# Altium project MCH_MAIN.PrjPcb (part 6 of 7)

## Sheet MB_clocking.SchDoc
size A
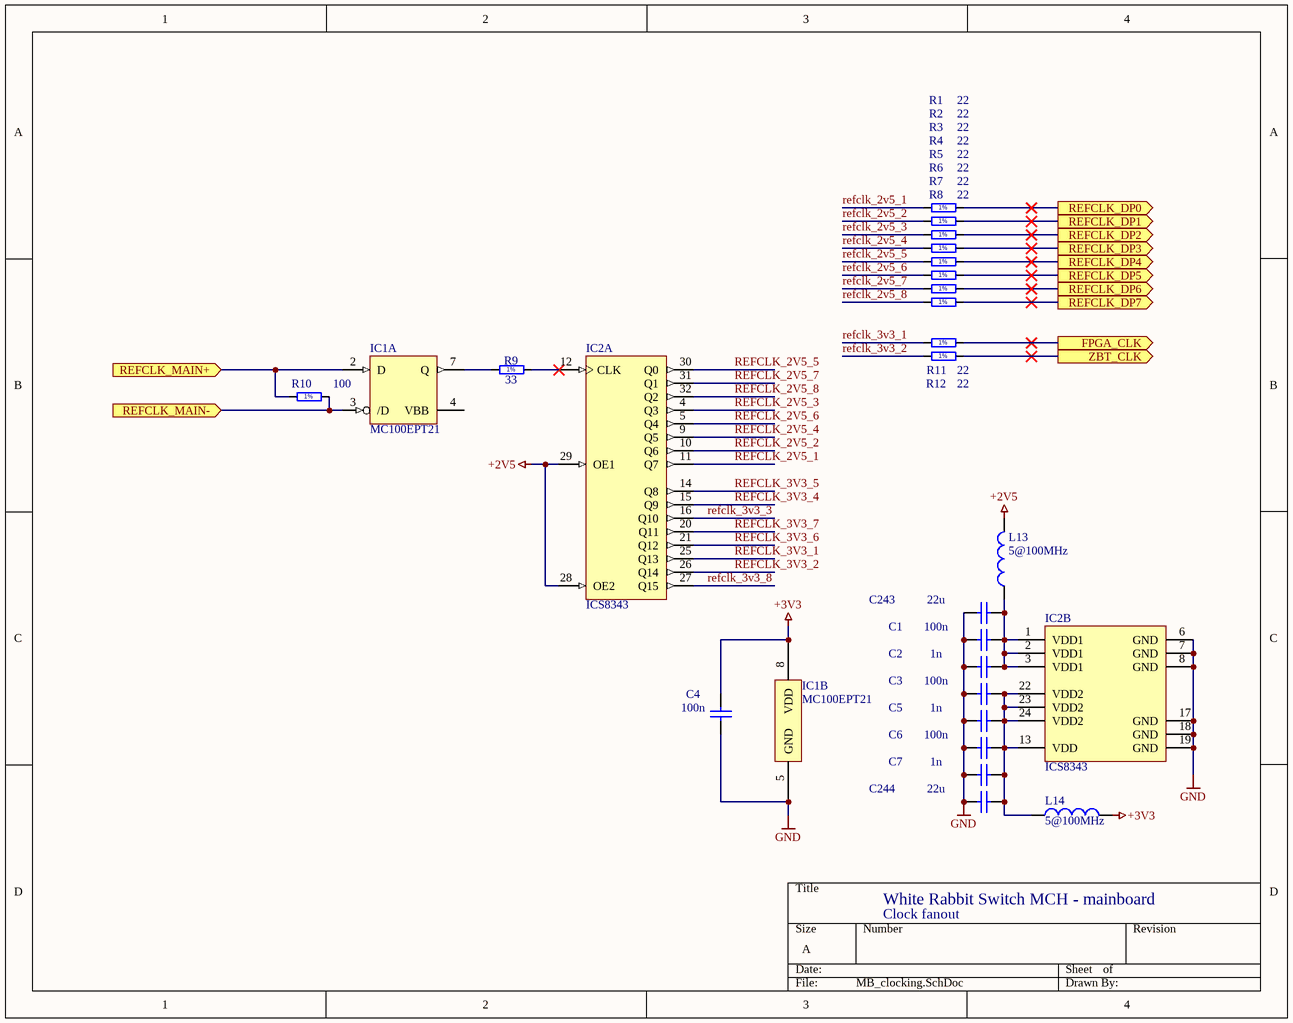
[diagram p16: MB_clocking.SchDoc]

### Parts
C1  100n  [CAPC1005X55N]
C2  1n  [CAPC1005X55N]
C3  100n  [CAPC1005X55N]
C4  100n  [CAPC1005X55N]
C5  1n  [CAPC1005X55N]
C6  100n  [CAPC1005X55N]
C7  1n  [CAPC1005X55N]
C243  22u  [CAPC2012X135N]
C244  22u  [CAPC2012X135N]
IC1  MC100EPT21  [TSOP65P490-8AN]  (parts A,B of 2)
IC2  ICS8343  [TQFP80P900X900-32AM]  (parts A,B of 2)
L13  value 5@100MHz  [INDC1608-0603]  (hidden comment: Inductor)
L14  value 5@100MHz  [INDC1608-0603]  (hidden comment: Inductor)
R1  22  [RESC1005X40N]
R2  22  [RESC1005X40N]
R3  22  [RESC1005X40N]
R4  22  [RESC1005X40N]
R5  22  [RESC1005X40N]
R6  22  [RESC1005X40N]
R7  22  [RESC1005X40N]
R8  22  [RESC1005X40N]
R9  33  [RESC1005X40N]
R10  100  [RESC1005X40N]
R11  22  [RESC1005X40N]
R12  22  [RESC1005X40N]

### Ports
FPGA_CLK (out), REFCLK_DP0 (out), REFCLK_DP1 (out), REFCLK_DP2 (out), REFCLK_DP3 (out), REFCLK_DP4 (out), REFCLK_DP5 (out), REFCLK_DP6 (out), REFCLK_DP7 (out), REFCLK_MAIN+ (in), REFCLK_MAIN- (in), ZBT_CLK (out)

### Nets
+2V5: IC2.28(OE2) IC2.29(OE1) L13.2
+3V3: C4.2 IC1.8(VDD) L14.2
GND: C1.2 C2.1 C3.2 C4.1 C5.1 C6.2 C7.1 C243.2 C244.2 IC1.5(GND) IC2.6(GND) IC2.7(GND) IC2.8(GND) IC2.17(GND) IC2.18(GND) IC2.19(GND)
fclkin_3v3_1: R11.2 ; port FPGA_CLK
refclk_2v5_1: IC2.11(Q7) R1.1
refclk_2v5_2: IC2.10(Q6) R2.1
refclk_2v5_3: IC2.4(Q3) R3.1
refclk_2v5_4: IC2.9(Q5) R4.1
refclk_2v5_5: IC2.30(Q0) R5.1
refclk_2v5_6: IC2.5(Q4) R6.1
refclk_2v5_7: IC2.31(Q1) R7.1
refclk_2v5_8: IC2.32(Q2) R8.1
refclk_3v3_1: IC2.25(Q13) R11.1
refclk_3v3_2: IC2.26(Q14) R12.1
refclk_3v3_3: IC2.16(Q10)
REFCLK_3V3_4: IC2.15(Q9)
REFCLK_3V3_5: IC2.14(Q8)
REFCLK_3V3_6: IC2.21(Q12)
REFCLK_3V3_7: IC2.20(Q11)
refclk_3v3_8: IC2.27(Q15)
REFCLK_DP0: R1.2 ; port REFCLK_DP0
REFCLK_DP1: R2.2 ; port REFCLK_DP1
REFCLK_DP2: R3.2 ; port REFCLK_DP2
REFCLK_DP3: R4.2 ; port REFCLK_DP3
REFCLK_DP4: R5.2 ; port REFCLK_DP4
REFCLK_DP5: R6.2 ; port REFCLK_DP5
REFCLK_DP6: R7.2 ; port REFCLK_DP6
REFCLK_DP7: R8.2 ; port REFCLK_DP7
REFCLK_MAIN+: IC1.2(D) R10.1 ; port REFCLK_MAIN+
REFCLK_MAIN-: IC1.3(/D) R10.2 ; port REFCLK_MAIN-
ZBT_CLK: R12.2 ; port ZBT_CLK
NetC1_1: C1.1 C2.2 C243.1 IC2.1(VDD1) IC2.2(VDD1) IC2.3(VDD1) L13.1
NetC3_1: C3.1 C5.2 C6.1 C7.2 C244.1 IC2.13(VDD) IC2.22(VDD2) IC2.23(VDD2) IC2.24(VDD2) L14.1
NetIC1_7: IC1.7(Q) R9.1
NetIC2_12: IC2.12(CLK) R9.2

Not connected (* = marked no-connect by the designer): IC1 4(VBB)

### Notes on the sheet
- White Rabbit Switch MCH - mainboard
- Clock fanout
- (in symbol R0402_22R_1%_0.0625W_100PPM) 1%
- (in symbol R0402_33R_1%_0.0625W_100PPM) 1%
- (in symbol R0402_100R_1%_0.0625W_100PPM) 1%

### Library data of the parts
C1 C3 C4 C6 = CC0402_100NF_16V_10%_X7R: Non-polarised capacitor; Part Description: SMD Multilayer Chip Ceramic Capacitor; Manufacturer: GENERIC; Manufacturer1 Part Number: 223878715649; Manufacturer1 Datasheet: \\cern.ch\dfs\Applications\Altium\Datasheets\CC0402_X7R_PHYCOMP.pdf; Value: 100nF; Voltage: 16V; TC: X7R; Tolerance: ±10%; Table: Capacitors SMD; Part Number: CC0402_100NF_16V_10%_X7R; Component Kind: Standard; Component Type: Standard; Designator: Capacitor - non polarized; Library Reference: Capacitor - non polarized; Pin Count: 2; Status: Not Recommended; Manufacturer Part Number: CC0402_100NF_16V_10%_X7R; Case: 0402; Mounted: Yes; Socket: No; SMD: Yes; Manufacturer1 Example: PHYCOMP; Manufacturer1 ComponentHeight: 0.55mm; HelpURL: \\cern.ch\dfs\Applications\Altium\Datasheets\CC0402_X7R_PHYCOMP.pdf; Author: CERN DEM JLC; CreateDate: 12/3/2007; LatestRevisionDate: 12/3/2007
C2 C5 C7 = CC0402_1.0NF_50V_10%_X7R: Non-polarised capacitor; Part Description: SMD Multilayer Chip Ceramic Capacitor; Manufacturer: GENERIC; Manufacturer1 Part Number: 223858715623; Manufacturer1 Datasheet: \\cern.ch\dfs\Applications\Altium\Datasheets\CC0402_X7R_PHYCOMP.pdf; Value: 1nF; Voltage: 50V; TC: X7R; Tolerance: ±10%; Table: Capacitors SMD; Part Number: CC0402_1.0NF_50V_10%_X7R; Component Kind: Standard; Component Type: Standard; Designator: Capacitor - non polarized; Library Reference: Capacitor - non polarized; Pin Count: 2; Status: Not Recommended; Manufacturer Part Number: CC0402_1.0NF_50V_10%_X7R; Case: 0402; Mounted: Yes; Socket: No; SMD: Yes; Manufacturer1 Example: PHYCOMP; Manufacturer1 ComponentHeight: 0.55mm; HelpURL: \\cern.ch\dfs\Applications\Altium\Datasheets\CC0402_X7R_PHYCOMP.pdf; Author: CERN DEM JLC; CreateDate: 12/3/2007; LatestRevisionDate: 12/3/2007
C243 C244 = CC0805_22uF_6.3V_20%_X5R: Non-polarised capacitor; Part Description: SMD Multilayer Chip Ceramic Capacitor; Manufacturer: GENERIC; Manufacturer1 Part Number: C0805C226M9PAC7800; Manufacturer1 Datasheet: \\cern.ch\dfs\Applications\Altium\Datasheets\CC1206_X5R_KEMET.pdf; Value: 22uF; Voltage: 6.3V; TC: X5R; Tolerance: ±20%; Table: Capacitors SMD; Part Number: CC0805_22uF_6.3V_20%_X5R; Component Kind: Standard; Component Type: Standard; Designator: Capacitor - non polarized; Library Reference: Capacitor - non polarized; Pin Count: 2; Status: Preferred; Manufacturer Part Number: CC0805_22uF_6.3V_20%_X5R; Case: 0805; Mounted: Yes; Socket: No; SMD: Yes; Manufacturer1 Example: KEMET; Manufacturer1 ComponentHeight: 1.45mm; HelpURL: \\cern.ch\dfs\Applications\Altium\Datasheets\CC1206_X5R_KEMET.pdf; Author: CERN DEM JLC; CreateDate: 12/3/2007; LatestRevisionDate: 12/3/2007
IC1 = MC100EPT21: ONSemi LVDS/LVPECL -> LVTTL/LVCMOS buffer; RefId: MC100EPT21DTGOS-ND; Supplier: Digikey; Value: MC100EPT21
IC2 = ICS8343: 1:16 LVCMOS fanout; RefId: 800-1112-ND; Value: ICS8343AYI-01LF; Supplier: Digikey
L13 L14 = Inductor: Ferrite bead; Published: 8-Jun-2000; Revision: July-2002: Re-released for DXP Platform.; Publisher: Altium Limited
R1-R8 R11 R12 = R0402_22R_1%_0.0625W_100PPM: Resistor - 1%; Part Description: General Purpose Thick Film Chip Resistor; Manufacturer: GENERIC; Manufacturer1 Part Number: 232270672209; Manufacturer1 Datasheet: \\cern.ch\dfs\Applications\Altium\Datasheets\R0402_Phycomp_RC0402.pdf; TC: ±100ppm/°C; Table: Resistors SMD; Part Number: R0402_22R_1%_0.0625W_100PPM; Component Kind: Standard; Component Type: Standard; Designator: Resistor - 1%; Library Reference: Resistor - 1%; Pin Count: 2; Value: 22; Status: Not recommended; Power: 0.0625W; Tolerance: ±1%; Manufacturer Part Number: R0402_22R_1%_0.0625W_100PPM; Case: 0402; Mounted: Yes; Socket: No; SMD: Yes; Manufacturer1 Example: PHYCOMP; Manufacturer1 ComponentHeight: 0.4mm; HelpURL: \\cern.ch\dfs\Applications\Altium\Datasheets\R0402_Phycomp_RC0402.pdf; Author: CERN DEM JLC; CreateDate: 12/3/2007; LatestRevisionDate: 3/13/2008
R9 = R0402_33R_1%_0.0625W_100PPM: Resistor - 1%; Part Description: General Purpose Thick Film Chip Resistor; Manufacturer: GENERIC; Manufacturer1 Part Number: 232270673309; Manufacturer1 Datasheet: \\cern.ch\dfs\Applications\Altium\Datasheets\R0402_Phycomp_RC0402.pdf; TC: ±100ppm/°C; Table: Resistors SMD; Part Number: R0402_33R_1%_0.0625W_100PPM; Component Kind: Standard; Component Type: Standard; Designator: Resistor - 1%; Library Reference: Resistor - 1%; Pin Count: 2; Value: 33; Status: Not recommended; Power: 0.0625W; Tolerance: ±1%; Manufacturer Part Number: R0402_33R_1%_0.0625W_100PPM; Case: 0402; Mounted: Yes; Socket: No; SMD: Yes; Manufacturer1 Example: PHYCOMP; Manufacturer1 ComponentHeight: 0.4mm; HelpURL: \\cern.ch\dfs\Applications\Altium\Datasheets\R0402_Phycomp_RC0402.pdf; Author: CERN DEM JLC; CreateDate: 12/3/2007; LatestRevisionDate: 3/13/2008
R10 = R0402_100R_1%_0.0625W_100PPM: Resistor - 1%; Part Description: General Purpose Thick Film Chip Resistor; Manufacturer: GENERIC; Manufacturer1 Part Number: 232270671001; Manufacturer1 Datasheet: \\cern.ch\dfs\Applications\Altium\Datasheets\R0402_Phycomp_RC0402.pdf; TC: ±100ppm/°C; Table: Resistors SMD; Part Number: R0402_100R_1%_0.0625W_100PPM; Component Kind: Standard; Component Type: Standard; Designator: Resistor - 1%; Library Reference: Resistor - 1%; Pin Count: 2; Value: 100; Status: Not recommended; Power: 0.0625W; Tolerance: ±1%; Manufacturer Part Number: R0402_100R_1%_0.0625W_100PPM; Case: 0402; Mounted: Yes; Socket: No; SMD: Yes; Manufacturer1 Example: PHYCOMP; Manufacturer1 ComponentHeight: 0.4mm; HelpURL: \\cern.ch\dfs\Applications\Altium\Datasheets\R0402_Phycomp_RC0402.pdf; Author: CERN DEM JLC; CreateDate: 12/3/2007; LatestRevisionDate: 3/13/2008

## Sheet MB_watchdog_mcu.SchDoc
size A3
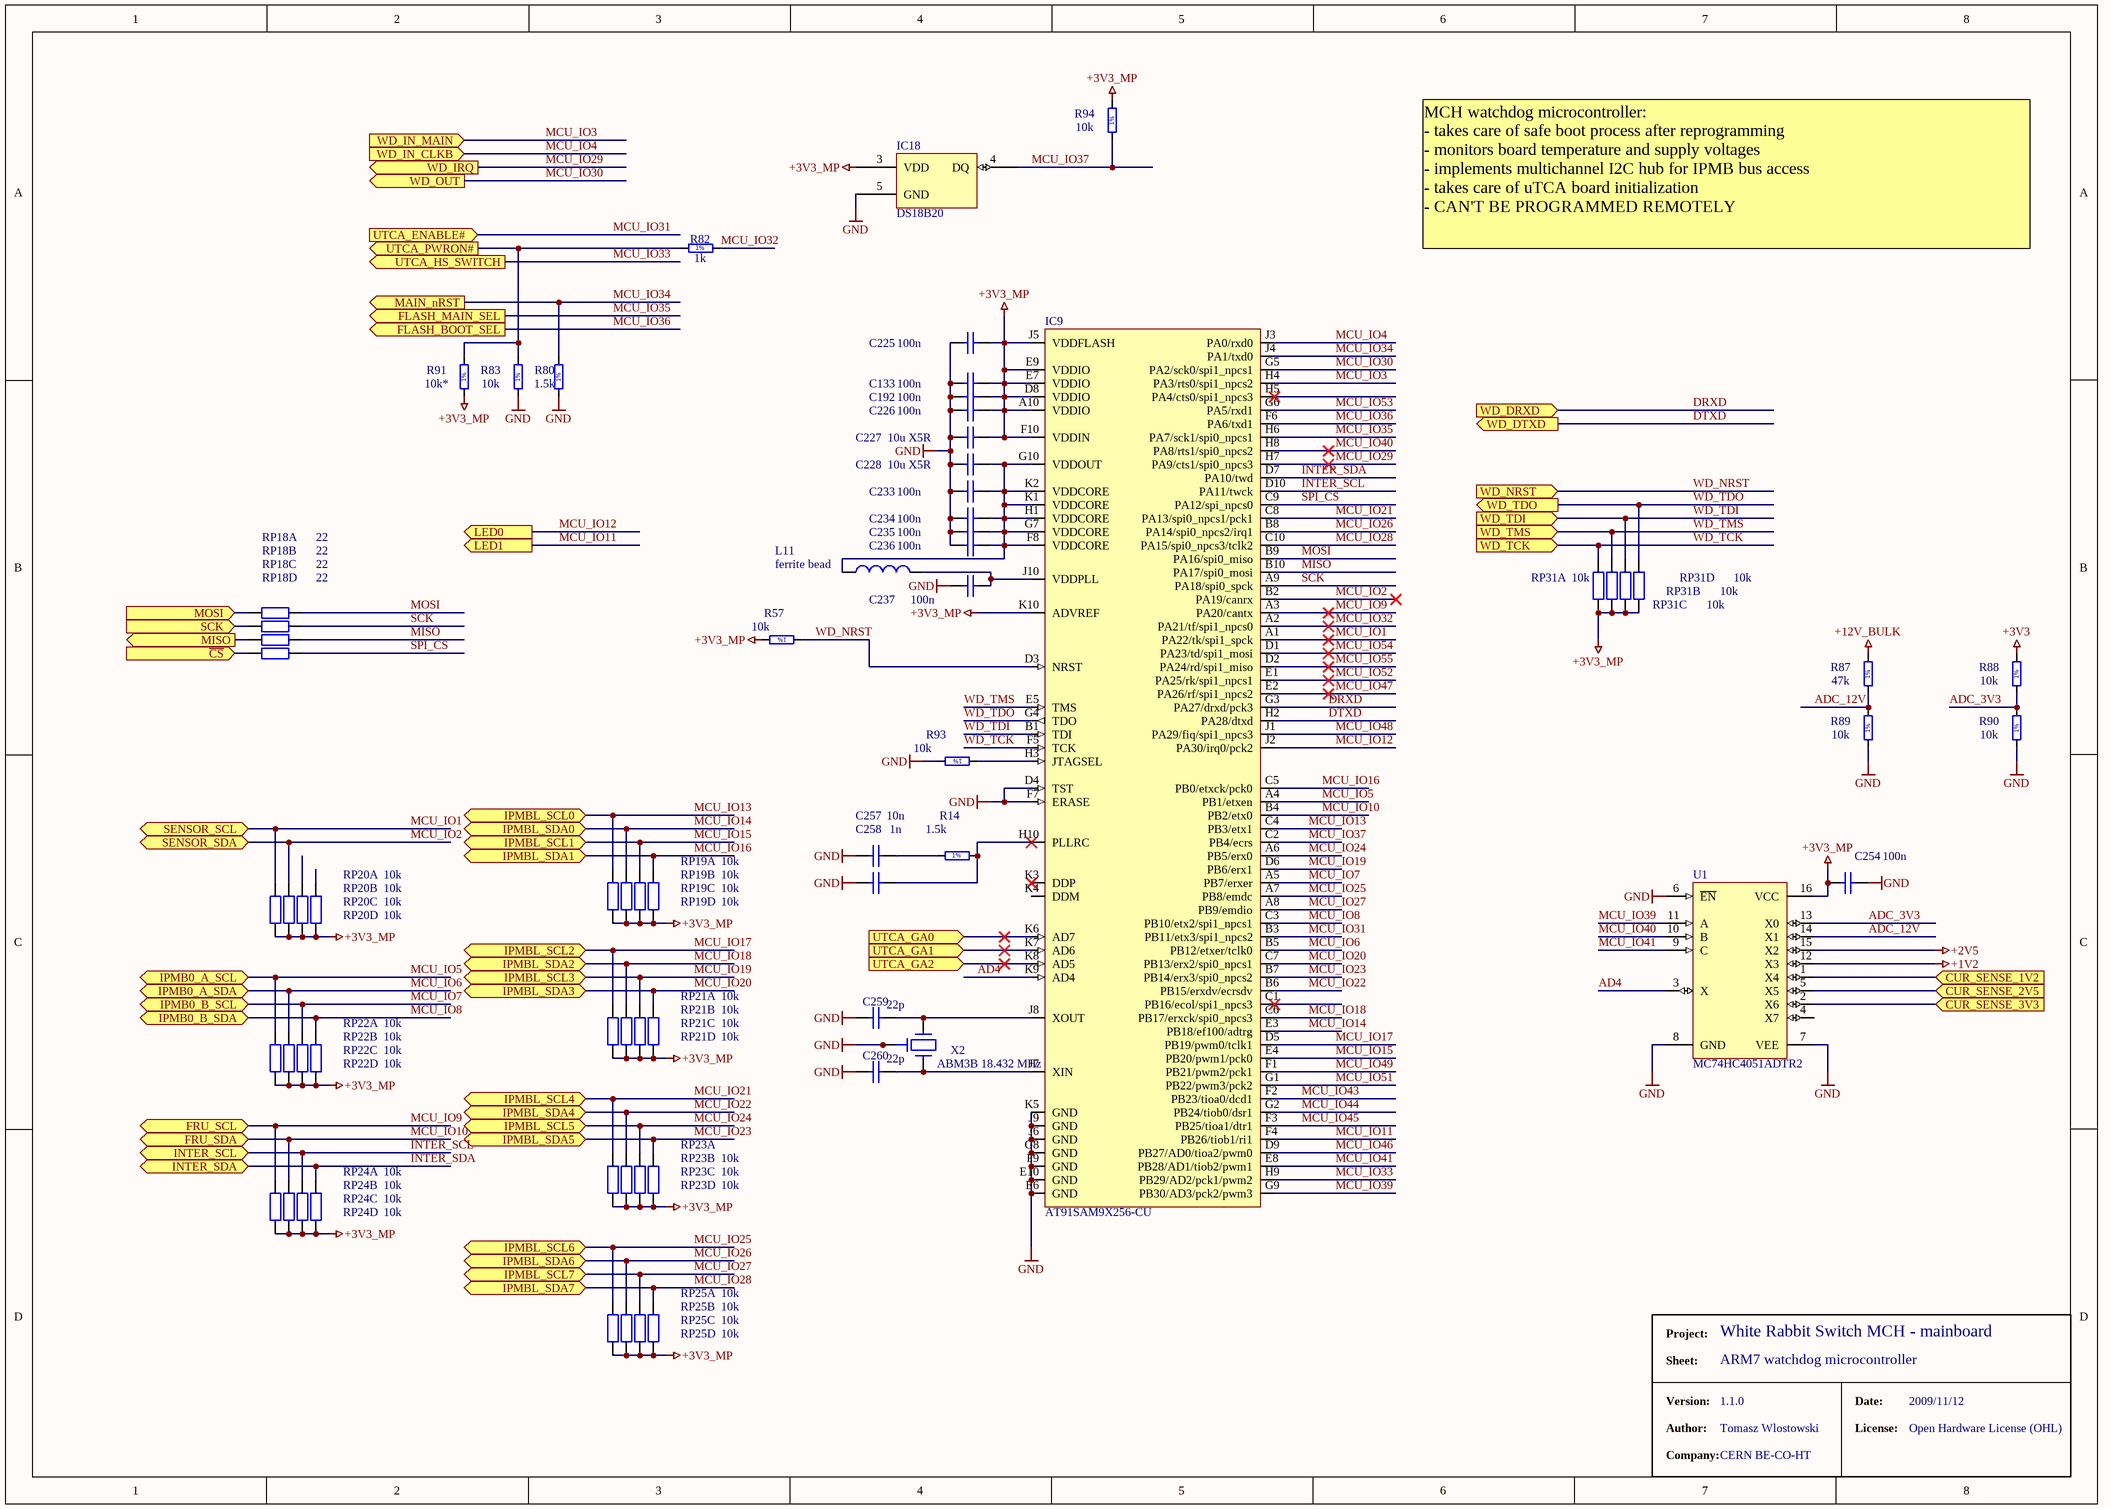
[diagram p17: MB_watchdog_mcu.SchDoc]

### Parts
(Parts that share a designator on the sheet are numbered #1, #2 ... from top to bottom, then left to right.)
C133#2  100n  [CAPC1005X55N]
C192#2  100n  [CAPC1005X55N]
C225  100n  [CAPC1005X55N]
C226  100n  [CAPC1005X55N]
C227  10u X5R  [CAPC1608X87N]
C228  10u X5R  [CAPC1608X87N]
C233  100n  [CAPC1005X55N]
C234  100n  [CAPC1005X55N]
C235  100n  [CAPC1005X55N]
C236  100n  [CAPC1005X55N]
C237  100n  [CAPC1005X55N]
C254  100n  [CAPC1005X55N]
C257  10n  [CAPC1005X55N]
C258  1n  [CAPC1005X55N]
C259  22p  [CAPC1005X55N]
C260  22p  [CAPC1005X55N]
IC9#2  AT91SAM9X256-CU  [TFBGA100x10]
IC18  DS18B20  [SOIC127P600-8AL]
L11  value ferrite bead  [INDC1608-0603]  (hidden comment: fer.bead)
R14  1.5k  [RESC1005X40N]
R57#2  10k  [RESC1005X40N]
R80#2  1.5k  [RESC1005X40N]
R82#2  1k  [RESC1005X40N]
R83#2  10k  [RESC1005X40N]
R87  47k  [RESC1005X40N]
R88  10k  [RESC1005X40N]
R89  10k  [RESC1005X40N]
R90  10k  [RESC1005X40N]
R91  10k*  [RESC1005X40N]
R93  10k  [RESC1005X40N]
R94  10k  [RESC1005X40N]
RP18  value 22  [YC124]  (hidden comment: 22R 0804)  (parts A,B,C,D of 4)
RP19  value 10k  [YC124]  (hidden comment: 10k 0804)  (parts A,B,C,D of 4)
RP20  value 10k  [YC124]  (hidden comment: 10k 0804)  (parts A,B,C,D of 4)
RP21  value 10k  [YC124]  (hidden comment: 10k 0804)  (parts A,B,C,D of 4)
RP22  value 10k  [YC124]  (hidden comment: 10k 0804)  (parts A,B,C,D of 4)
RP23  10k 0804  [YC124]  (value not drawn)  (parts A,B,C,D of 4)
RP24  value 10k  [YC124]  (hidden comment: 10k 0804)  (parts A,B,C,D of 4)
RP25  value 10k  [YC124]  (hidden comment: 10k 0804)  (parts A,B,C,D of 4)
RP31  value 10k  [YC124]  (hidden comment: 10k 0804)  (parts A,B,C,D of 4)
U1  MC74HC4051ADTR2  [948F-01]
X2#2  ABM3B 18.432 MHz  [XTALL_ABM3]

### Ports
CUR_SENSE_1V2 (in), CUR_SENSE_2V5 (in), CUR_SENSE_3V3 (in), FLASH_BOOT_SEL (out), FLASH_MAIN_SEL (out), FRU_SCL (bidir), FRU_SDA (bidir), INTER_SCL (bidir), INTER_SDA (bidir), IPMB0_A_SCL (bidir), IPMB0_A_SDA (bidir), IPMB0_B_SCL (bidir), IPMB0_B_SDA (bidir), IPMBL_SCL0 (bidir), IPMBL_SCL1 (bidir), IPMBL_SCL2 (bidir), IPMBL_SCL3 (bidir), IPMBL_SCL4 (bidir), IPMBL_SCL5 (bidir), IPMBL_SCL6 (bidir), IPMBL_SCL7 (bidir), IPMBL_SDA0 (bidir), IPMBL_SDA1 (bidir), IPMBL_SDA2 (bidir), IPMBL_SDA3 (bidir), IPMBL_SDA4 (bidir), IPMBL_SDA5 (bidir), IPMBL_SDA6 (bidir), IPMBL_SDA7 (bidir), LED0 (out), LED1 (out), MAIN_nRST (out), MISO (out), MOSI (in), SCK (in), SENSOR_SCL (bidir), SENSOR_SDA (bidir), UTCA_ENABLE# (in), UTCA_GA0 (in), UTCA_GA1 (in), UTCA_GA2 (in), UTCA_HS_SWITCH (out), UTCA_PWRON# (out), WD_DRXD (in), WD_DTXD (out), WD_IN_CLKB (in), WD_IN_MAIN (in), WD_IRQ (out), WD_NRST (in), WD_OUT (out), WD_TCK (in), WD_TDI (in), WD_TDO (out), WD_TMS (in), ~{CS} (in)

### Nets
+1V2: U1.12(X3)
+2V5: U1.15(X2)
+3V3: R88.2
+3V3_MP: C133#2.2 C192#2.2 C225.2 C226.2 C227.2 C254.1 IC9#2.A10(VDDIO) IC9#2.D8(VDDIO) IC9#2.E7(VDDIO) IC9#2.E9(VDDIO) IC9#2.F10(VDDIN) IC9#2.J5(VDDFLASH) IC9#2.K10(ADVREF) IC18.3(VDD) R57#2.2 R91.1 R94.2 RP19.1(A) RP19.2(A) RP19.3(A) RP19.4(A) RP20.1(A) RP20.2(A) RP20.3(A) RP20.4(A) RP21.1(A) RP21.2(A) RP21.3(A) RP21.4(A) RP22.1(A) RP22.2(A) RP22.3(A) RP22.4(A) RP23.1(A) RP23.2(A) RP23.3(A) RP23.4(A) RP24.1(A) RP24.2(A) RP24.3(A) RP24.4(A) RP25.1(A) RP25.2(A) RP25.3(A) RP25.4(A) RP31.1(A) RP31.2(A) RP31.3(A) RP31.4(A) U1.16(VCC)
+12V_BULK: R87.2
GND: C133#2.1 C192#2.1 C225.1 C226.1 C227.1 C228.1 C233.1 C234.1 C235.1 C236.1 C237.1 C254.2 C257.1 C258.1 C259.1 C260.1 IC9#2.D4(TST) IC9#2.E6(GND) IC9#2.E10(GND) IC9#2.F7(ERASE) IC9#2.F9(GND) IC9#2.G8(GND) IC9#2.J6(GND) IC9#2.J9(GND) IC9#2.K5(GND) IC18.5(GND) R80#2.1 R83#2.1 R89.1 R90.1 R93.2 U1.6(~{EN}) U1.7(VEE) U1.8(GND) X2#2.2 X2#2.4
AD4: IC9#2.K9(AD4) U1.3(X)
ADC_3V3: R88.1 R90.2 U1.13(X0)
ADC_12V: R87.1 R89.2 U1.14(X1)
CUR_SENSE_1V2: U1.1(X4) ; port CUR_SENSE_1V2
CUR_SENSE_2V5: U1.5(X5) ; port CUR_SENSE_2V5
CUR_SENSE_3V3: U1.2(X6) ; port CUR_SENSE_3V3
DRXD: IC9#2.G3(PA27/drxd/pck3) ; port WD_DRXD
DTXD: IC9#2.H2(PA28/dtxd) ; port WD_DTXD
INTER_SCL: IC9#2.D10(PA11/twck) RP24.5(B) ; port INTER_SCL
INTER_SDA: IC9#2.D7(PA10/twd) RP24.6(B) ; port INTER_SDA
MCU_IO1: IC9#2.A1(PA22/tk/spi1_spck) RP20.8(B) ; port SENSOR_SCL
MCU_IO2: IC9#2.B2(PA19/canrx) RP20.7(B) ; port SENSOR_SDA
MCU_IO3: IC9#2.H4(PA3/rts0/spi1_npcs2) ; port WD_IN_MAIN  [project net IWD_OUT]
MCU_IO4: IC9#2.J3(PA0/rxd0) ; port WD_IN_CLKB
MCU_IO5: IC9#2.A4(PB1/etxen) RP22.8(B) ; port IPMB0_A_SCL  [project net IPMB0_A_SCL]
MCU_IO6: IC9#2.B5(PB12/etxer/tclk0) RP22.7(B) ; port IPMB0_A_SDA  [project net IPMB0_A_SDA]
MCU_IO7: IC9#2.A5(PB7/erxer) RP22.6(B) ; port IPMB0_B_SCL  [project net IPMB0_B_SCL]
MCU_IO8: IC9#2.C3(PB10/etx2/spi1_npcs1) RP22.5(B) ; port IPMB0_B_SDA  [project net IPMB0_B_SDA]
MCU_IO9: IC9#2.A3(PA20/cantx) RP24.8(B) ; port FRU_SCL  [project net FRU_SCL]
MCU_IO10: IC9#2.B4(PB2/etx0) RP24.7(B) ; port FRU_SDA  [project net FRU_SDA]
MCU_IO11: IC9#2.F4(PB26/tiob1/ri1) ; port LED1  [project net FP_UTCA_LED1]
MCU_IO12: IC9#2.J2(PA30/irq0/pck2) ; port LED0  [project net FP_UTCA_LED0]
MCU_IO13: IC9#2.C4(PB3/etx1) RP19.8(B) ; port IPMBL_SCL0  [project net IPMBL_SCL0]
MCU_IO14: IC9#2.E3(PB18/ef100/adtrg) RP19.7(B) ; port IPMBL_SDA0  [project net IPMBL_SDA0]
MCU_IO15: IC9#2.E4(PB20/pwm1/pck0) RP19.6(B) ; port IPMBL_SCL1  [project net IPMBL_SCL1]
MCU_IO16: IC9#2.C5(PB0/etxck/pck0) RP19.5(B) ; port IPMBL_SDA1  [project net IPMBL_SDA1]
MCU_IO17: IC9#2.D5(PB19/pwm0/tclk1) RP21.8(B) ; port IPMBL_SCL2  [project net IPMBL_SCL2]
MCU_IO18: IC9#2.C6(PB17/erxck/spi0_npcs3) RP21.7(B) ; port IPMBL_SDA2  [project net IPMBL_SDA2]
MCU_IO19: IC9#2.D6(PB6/erx1) RP21.6(B) ; port IPMBL_SCL3  [project net IPMBL_SCL3]
MCU_IO20: IC9#2.C7(PB13/erx2/spi0_npcs1) RP21.5(B) ; port IPMBL_SDA3  [project net IPMBL_SDA3]
MCU_IO21: IC9#2.C8(PA13/spi0_npcs1/pck1) RP23.8(B) ; port IPMBL_SCL4  [project net IPMBL_SCL4]
MCU_IO22: IC9#2.B6(PB15/erxdv/ecrsdv) RP23.7(B) ; port IPMBL_SDA4  [project net IPMBL_SDA4]
MCU_IO23: IC9#2.B7(PB14/erx3/spi0_npcs2) RP23.5(B) ; port IPMBL_SDA5  [project net IPMBL_SDA5]
MCU_IO24: IC9#2.A6(PB5/erx0) RP23.6(B) ; port IPMBL_SCL5  [project net IPMBL_SCL5]
MCU_IO25: IC9#2.A7(PB8/emdc) RP25.8(B) ; port IPMBL_SCL6  [project net IPMBL_SCL6]
MCU_IO26: IC9#2.B8(PA14/spi0_npcs2/irq1) RP25.7(B) ; port IPMBL_SDA6  [project net IPMBL_SDA6]
MCU_IO27: IC9#2.A8(PB9/emdio) RP25.6(B) ; port IPMBL_SCL7  [project net IPMBL_SCL7]
MCU_IO28: IC9#2.C10(PA15/spi0_npcs3/tclk2) RP25.5(B) ; port IPMBL_SDA7  [project net IPMBL_SDA7]
MCU_IO29: IC9#2.H7(PA9/cts1/spi0_npcs3) ; port WD_IRQ
MCU_IO30: IC9#2.G5(PA2/sck0/spi1_npcs1) ; port WD_OUT  [project net IWD_IN]
MCU_IO31: IC9#2.B3(PB11/etx3/spi1_npcs2) ; port UTCA_ENABLE#
MCU_IO32: IC9#2.A2(PA21/tf/spi1_npcs0) R82#2.2
MCU_IO33: IC9#2.H9(PB29/AD2/pck1/pwm2) ; port UTCA_HS_SWITCH  [project net FP_UTCA_HSWAPSW]
MCU_IO34: IC9#2.J4(PA1/txd0) R80#2.2 ; port MAIN_nRST  [project net MAIN_nRST]
MCU_IO35: IC9#2.H6(PA7/sck1/spi0_npcs1) ; port FLASH_MAIN_SEL  [project net FMAIN_SEL]
MCU_IO36: IC9#2.F6(PA6/txd1) ; port FLASH_BOOT_SEL  [project net FBOOT_SEL]
MCU_IO37: IC9#2.C2(PB4/ecrs) IC18.4(DQ) R94.1
MCU_IO39: IC9#2.G9(PB30/AD3/pck2/pwm3) U1.11(A)
MCU_IO40: IC9#2.H8(PA8/rts1/spi0_npcs2) U1.10(B)
MCU_IO41: IC9#2.E8(PB28/AD1/tiob2/pwm1) U1.9(C)
MCU_IO43: IC9#2.F2(PB23/tioa0/dcd1)
MCU_IO44: IC9#2.G2(PB24/tiob0/dsr1)
MCU_IO45: IC9#2.F3(PB25/tioa1/dtr1)
MCU_IO46: IC9#2.D9(PB27/AD0/tioa2/pwm0)
MCU_IO47: IC9#2.E2(PA26/rf/spi1_npcs2)
MCU_IO48: IC9#2.J1(PA29/fiq/spi1_npcs3)
MCU_IO49: IC9#2.F1(PB21/pwm2/pck1)
MCU_IO51: IC9#2.G1(PB22/pwm3/pck2)
MCU_IO52: IC9#2.E1(PA25/rk/spi1_npcs1)
MCU_IO53: IC9#2.G6(PA5/rxd1)
MCU_IO54: IC9#2.D1(PA23/td/spi1_mosi)
MCU_IO55: IC9#2.D2(PA24/rd/spi1_miso)
MISO: IC9#2.B10(PA17/spi0_mosi) RP18.6(B)
MOSI: IC9#2.B9(PA16/spi0_miso) RP18.8(B)
SCK: IC9#2.A9(PA18/spi0_spck) RP18.7(B)
SPI_CS: IC9#2.C9(PA12/spi_npcs0) RP18.5(B)
UTCA_GA0: IC9#2.K6(AD7) ; port UTCA_GA0
UTCA_GA1: IC9#2.K7(AD6) ; port UTCA_GA1
UTCA_GA2: IC9#2.K8(AD5) ; port UTCA_GA2
UTCA_PWRON#: R82#2.1 R83#2.2 R91.2 ; port UTCA_PWRON#
WD_CS: RP18.4(A) ; port ~{CS}
WD_MISO: RP18.3(A) ; port MISO
WD_MOSI: RP18.1(A) ; port MOSI
WD_NRST: IC9#2.D3(NRST) R57#2.1 ; port WD_NRST
WD_SCK: RP18.2(A) ; port SCK
WD_TCK: IC9#2.F5(TCK) RP31.8(B) ; port WD_TCK
WD_TDI: IC9#2.B1(TDI) RP31.5(B) ; port WD_TDI
WD_TDO: IC9#2.G4(TDO) RP31.7(B) ; port WD_TDO
WD_TMS: IC9#2.E5(TMS) RP31.6(B) ; port WD_TMS
NetC228_2: C228.2 C233.2 C234.2 C235.2 C236.2 IC9#2.F8(VDDCORE) IC9#2.G7(VDDCORE) IC9#2.G10(VDDOUT) IC9#2.H1(VDDCORE) IC9#2.K1(VDDCORE) IC9#2.K2(VDDCORE) L11.1
NetC237_2: C237.2 IC9#2.J10(VDDPLL) L11.2
NetC257_2: C257.2 R14.1
NetC258_2: C258.2 IC9#2.H10(PLLRC) R14.2
NetC259_2: C259.2 IC9#2.J8(XOUT) X2#2.1
NetC260_2: C260.2 IC9#2.J7(XIN) X2#2.3
NetIC9#2_H3: IC9#2.H3(JTAGSEL) R93.1

Not connected (* = marked no-connect by the designer): IC9#2 C1(PB16/ecol/spi1_npcs3)* H5(PA4/cts0/spi1_npcs3)* K3(DDP)* K4(DDM); RP20 5(B) 6(B); U1 4(X7)

### Notes on the sheet
- !
- MCH watchdog microcontroller:
  - takes care of safe boot process after reprogramming
  - monitors board temperature and supply voltages
  - implements multichannel I2C hub for IPMB bus access
  - takes care of uTCA board initialization
  - CAN'T BE PROGRAMMED REMOTELY
- Project:
- Sheet:
- ARM7 watchdog microcontroller
- White Rabbit Switch MCH - mainboard
- Version:
- Author:
- Company:
- 1.1.0
- Tomasz Wlostowski
- CERN BE-CO-HT
- Date:
- License:
- 2009/11/12
- Open Hardware License (OHL)
- (in symbol R0402_1K5_1%_0.0625W_100PPM) 1%
- (in symbol R0402_1K_1%_0.0625W_100PPM) 1%
- (in symbol R0402_10K_1%_0.0625W_100PPM) 1%
- (in symbol R0402_47K_1%_0.0625W_100PPM) 1%

### Library data of the parts
C133#2 C192#2 C225 C226 C233-C237 C254 = CC0402_100NF_16V_10%_X7R: as C1 on sheet MB_clocking; Part Number: CC0402_100NF_16V_10%_X7R; Component Kind: Standard; Component Type: Standard; Designator: Capacitor - non polarized; Library Reference: Capacitor - non polarized; Pin Count: 2; Status: Not Recommended; Manufacturer Part Number: CC0402_100NF_16V_10%_X7R; Case: 0402; Mounted: Yes; Socket: No; SMD: Yes; Manufacturer1 Example: PHYCOMP; Manufacturer1 ComponentHeight: 0.55mm; HelpURL: \\cern.ch\dfs\Applications\Altium\Datasheets\CC0402_X7R_PHYCOMP.pdf; Author: CERN DEM JLC; CreateDate: 12/3/2007; LatestRevisionDate: 12/3/2007
C227 C228 = CC0603_10UF_6.3V_20%_X5R: Non-polarised capacitor; Part Description: SMD Multilayer Chip Ceramic Capacitor; Manufacturer: GENERIC; Manufacturer1 Part Number: C0603C106M9PAC; Manufacturer1 Datasheet: \\cern.ch\dfs\Applications\Altium\Datasheets\CC0603_X5R_KEMET.pdf; Value: 10uF; Voltage: 6.3V; Tolerance: ±20%; Table: Capacitors SMD; Part Number: CC0603_10UF_6.3V_20%_X5R; Component Kind: Standard; Component Type: Standard; Designator: Capacitor - non polarized; Library Reference: Capacitor - non polarized; Pin Count: 2; Status: Preferred; TC: X5R; Manufacturer Part Number: CC0603_10uF_6.3V_20%_X5R; Case: 0603; Mounted: Yes; Socket: No; SMD: Yes; Manufacturer1 Example: KEMET; Manufacturer1 ComponentHeight: 0.95mm; HelpURL: \\cern.ch\dfs\Applications\Altium\Datasheets\CC0603_X5R_KEMET.pdf; Author: CERN DEM JLC; CreateDate: 2007-12-03; LatestRevisionDate: 2007-12-03
C257 = CC0402_10NF_16V_10%_X7R: Non-polarised capacitor; Part Description: SMD Multilayer Chip Ceramic Capacitor; Manufacturer: GENERIC; Manufacturer1 Part Number: 223878715636; Manufacturer1 Datasheet: \\cern.ch\dfs\Applications\Altium\Datasheets\CC0402_X7R_PHYCOMP.pdf; Value: 10nF; Voltage: 16V; TC: X7R; Tolerance: ±10%; Table: Capacitors SMD; Part Number: CC0402_10NF_16V_10%_X7R; Component Kind: Standard; Component Type: Standard; Designator: Capacitor - non polarized; Library Reference: Capacitor - non polarized; Pin Count: 2; Status: Not Recommended; Manufacturer Part Number: CC0402_10NF_16V_10%_X7R; Case: 0402; Mounted: Yes; Socket: No; SMD: Yes; Manufacturer1 Example: PHYCOMP; Manufacturer1 ComponentHeight: 0.55mm; HelpURL: \\cern.ch\dfs\Applications\Altium\Datasheets\CC0402_X7R_PHYCOMP.pdf; Author: CERN DEM JLC; CreateDate: 2007-12-03; LatestRevisionDate: 2007-12-03
C258 = CC0402_1NF_50V_10%_X7R: Non-polarised capacitor; Part Description: SMD Multilayer Chip Ceramic Capacitor; Manufacturer: GENERIC; Manufacturer1 Part Number: 223858715623; Manufacturer1 Datasheet: \\cern.ch\dfs\Applications\Altium\Datasheets\CC0402_X7R_PHYCOMP.pdf; Value: 1nF; Voltage: 50V; TC: X7R; Tolerance: ±10%; Table: Capacitors SMD; Part Number: CC0402_1NF_50V_10%_X7R; Component Kind: Standard; Component Type: Standard; Designator: Capacitor - non polarized; Library Reference: Capacitor - non polarized; Pin Count: 2; Status: Not Recommended; Manufacturer Part Number: CC0402_1NF_50V_10%_X7R; Case: 0402; Mounted: Yes; Socket: No; SMD: Yes; Manufacturer1 Example: PHYCOMP; Manufacturer1 ComponentHeight: 0.55mm; HelpURL: \\cern.ch\dfs\Applications\Altium\Datasheets\CC0402_X7R_PHYCOMP.pdf; Author: CERN DEM JLC; CreateDate: 2007-12-03; LatestRevisionDate: 2007-12-03
C259 C260 = CC0402_22PF_50V_5%_NP0: Non-polarised capacitor; Part Description: SMD Multilayer Chip Ceramic Capacitor; Manufacturer: GENERIC; Manufacturer1 Part Number: 223886915229; Manufacturer1 Datasheet: \\cern.ch\dfs\Applications\Altium\Datasheets\CC0402_NP0_PHYCOMP.pdf; Value: 22pF; Voltage: 50V; TC: NP0; Tolerance: ±5%; Table: Capacitors SMD; Part Number: CC0402_22PF_50V_5%_NP0; Component Kind: Standard; Component Type: Standard; Designator: Capacitor - non polarized; Library Reference: Capacitor - non polarized; Pin Count: 2; Status: Not Recommended; Manufacturer Part Number: CC0402_22PF_50V_5%_NP0; Case: 0402; Mounted: Yes; Socket: No; SMD: Yes; Manufacturer1 Example: PHYCOMP; Manufacturer1 ComponentHeight: 0.55mm; HelpURL: \\cern.ch\dfs\Applications\Altium\Datasheets\CC0402_NP0_PHYCOMP.pdf; Author: CERN DEM JLC; CreateDate: 2007-12-03; LatestRevisionDate: 2007-12-03
IC9#2 = AT91SAM7X256: Atmel ARM7 microcontroller with 256kB flash; RefId: Mouser/556-A91SAM7X256CU
IC18 = DS18B20Z: 1-wire thermometer/ID chip; RefId: 1379772; Value: DS18B20Z; Supplier: Farnell
L11 = Inductor: Ferrite bead; Published: 8-Jun-2000; Revision: July-2002: Re-released for DXP Platform.; Publisher: Altium Limited
R14 = R0402_1K5_1%_0.0625W_100PPM: Resistor - 1%; Part Description: General Purpose Thick Film Chip Resistor; Manufacturer: GENERIC; Manufacturer1 Part Number: 232270671502; Manufacturer1 Datasheet: \\cern.ch\dfs\Applications\Altium\Datasheets\R0402_Phycomp_RC0402.pdf; Value: 1k5; TC: ±100ppm/°C; Table: Resistors SMD; Part Number: R0402_1K5_1%_0.0625W_100PPM; Component Kind: Standard; Component Type: Standard; Designator: Resistor - 1%; Library Reference: Resistor - 1%; Pin Count: 2; Status: Not recommended; Power: 0.0625W; Tolerance: ±1%; Manufacturer Part Number: R0402_1K5_1%_0.0625W_100PPM; Case: 0402; Mounted: Yes; Socket: No; SMD: Yes; Manufacturer1 Example: PHYCOMP; Manufacturer1 ComponentHeight: 0.4mm; HelpURL: \\cern.ch\dfs\Applications\Altium\Datasheets\R0402_Phycomp_RC0402.pdf; Author: CERN DEM JLC; CreateDate: 2007-12-03; LatestRevisionDate: 2008-03-13
R57#2 R83#2 R88-R90 R93 R94 = R0402_10K_1%_0.0625W_100PPM: as R103-R108 on sheet MB_power_supply; Part Number: R0402_10K_1%_0.0625W_100PPM; Component Kind: Standard; Component Type: Standard; Designator: Resistor - 1%; Library Reference: Resistor - 1%; Pin Count: 2; Value: 10k; Status: Not recommended; Power: 0.0625W; Tolerance: ±1%; Manufacturer Part Number: R0402_10K_1%_0.0625W_100PPM; Case: 0402; Mounted: Yes; Socket: No; SMD: Yes; Manufacturer1 Example: PHYCOMP; Manufacturer1 ComponentHeight: 0.4mm; HelpURL: \\cern.ch\dfs\Applications\Altium\Datasheets\R0402_Phycomp_RC0402.pdf; Author: CERN DEM JLC; CreateDate: 12/3/2007; LatestRevisionDate: 3/13/2008
R80#2 R91 = R0402_10K_1%_0.0625W_100PPM: Resistor - 1%; Part Description: General Purpose Thick Film Chip Resistor; Manufacturer: GENERIC; Manufacturer1 Part Number: 232270671003; Manufacturer1 Datasheet: \\cern.ch\dfs\Applications\Altium\Datasheets\R0402_Phycomp_RC0402.pdf; Value: 10k; TC: ±100ppm/°C; Table: Resistors SMD; Part Number: R0402_10K_1%_0.0625W_100PPM; Component Kind: Standard; Component Type: Standard; Designator: Resistor - 1%; Library Reference: Resistor - 1%; Pin Count: 2; Status: Not recommended; Power: 0.0625W; Tolerance: ±1%; Manufacturer Part Number: R0402_10K_1%_0.0625W_100PPM; Case: 0402; Mounted: Yes; Socket: No; SMD: Yes; Manufacturer1 Example: PHYCOMP; Manufacturer1 ComponentHeight: 0.4mm; HelpURL: \\cern.ch\dfs\Applications\Altium\Datasheets\R0402_Phycomp_RC0402.pdf; Author: CERN DEM JLC; CreateDate: 12/3/2007; LatestRevisionDate: 3/13/2008
R82#2 = R0402_1K_1%_0.0625W_100PPM: Resistor - 1%; Part Description: General Purpose Thick Film Chip Resistor; Manufacturer: GENERIC; Manufacturer1 Part Number: 232270671002; Manufacturer1 Datasheet: \\cern.ch\dfs\Applications\Altium\Datasheets\R0402_Phycomp_RC0402.pdf; TC: ±100ppm/°C; Table: Resistors SMD; Part Number: R0402_1K_1%_0.0625W_100PPM; Component Kind: Standard; Component Type: Standard; Designator: Resistor - 1%; Library Reference: Resistor - 1%; Pin Count: 2; Value: 1k; Status: Not recommended; Power: 0.0625W; Tolerance: ±1%; Manufacturer Part Number: R0402_1K_1%_0.0625W_100PPM; Case: 0402; Mounted: Yes; Socket: No; SMD: Yes; Manufacturer1 Example: PHYCOMP; Manufacturer1 ComponentHeight: 0.4mm; HelpURL: \\cern.ch\dfs\Applications\Altium\Datasheets\R0402_Phycomp_RC0402.pdf; Author: CERN DEM JLC; CreateDate: 2007-12-03; LatestRevisionDate: 2008-03-13
R87 = R0402_47K_1%_0.0625W_100PPM: Resistor - 1%; Part Description: General Purpose Thick Film Chip Resistor; Manufacturer: GENERIC; Manufacturer1 Part Number: 232270675103; Manufacturer1 Datasheet: \\cern.ch\dfs\Applications\Altium\Datasheets\R0402_Phycomp_RC0402.pdf; TC: ±100ppm/°C; Table: Resistors SMD; Part Number: R0402_47K_1%_0.0625W_100PPM; Component Kind: Standard; Component Type: Standard; Designator: Resistor - 1%; Library Reference: Resistor - 1%; Pin Count: 2; Value: 47k; Status: Not recommended; Power: 0.0625W; Tolerance: ±1%; Manufacturer Part Number: R0402_47K_1%_0.0625W_100PPM; Case: 0402; Mounted: Yes; Socket: No; SMD: Yes; Manufacturer1 Example: PHYCOMP; Manufacturer1 ComponentHeight: 0.4mm; HelpURL: \\cern.ch\dfs\Applications\Altium\Datasheets\R0402_Phycomp_RC0402.pdf; Author: CERN DEM JLC; CreateDate: 12/3/2007; LatestRevisionDate: 3/13/2008
RP18 = Res_Pack4_22R_YC124: 4-resistor pack; RefId: AVX  CRB2A4 series; Supplier: Farnell
RP19-RP25 RP31 = Res_Pack4_10k_YC124: 4-resistor pack; RefId: AVX  CRB2A4 series; Supplier: Farnell
U1 = MC74HC4051ADTR2: Analog Multiplexer/Demultiplexer; Published: 17-Jul-2002; LatestRevisionDate: 06-Jun-2005; LatestRevisionNote: Stylized 3D Model Added; DatasheetVersion: Mar-2000; PackageVersion: Mar-2000; PackageReference: 948F-01; Publisher: Altium Limited; PackageDescription: Shrink Small Outline; 16 Leads; Body Width 4.4 mm; Pitch 0.65 mm; ComponentLink1Description: Manufacturer Link; ComponentLink1URL: http://www.onsemi.com/site/products/parametrics/0,4446,47,00.html; ComponentLink2Description: Datasheet; ComponentLink2URL: http://www.onsemi.com/pub/Collateral/MC74HC4051A-D.PDF
X2#2 = X_CRYSTAL_SMD_ABM8: Miniature crystal oscillator (ABRACON); Value: ABM3B-18.432MHZ-B2-T; RefId: 1611814; Supplier: Farnell

## Sheet MB_downlink_phy.SchDoc
size A4
Used 8 times, as channels DP0, DP1, DP2, DP3, DP4, DP5, DP6, DP7. Parts and nets are listed once, with the designators drawn on the sheet.
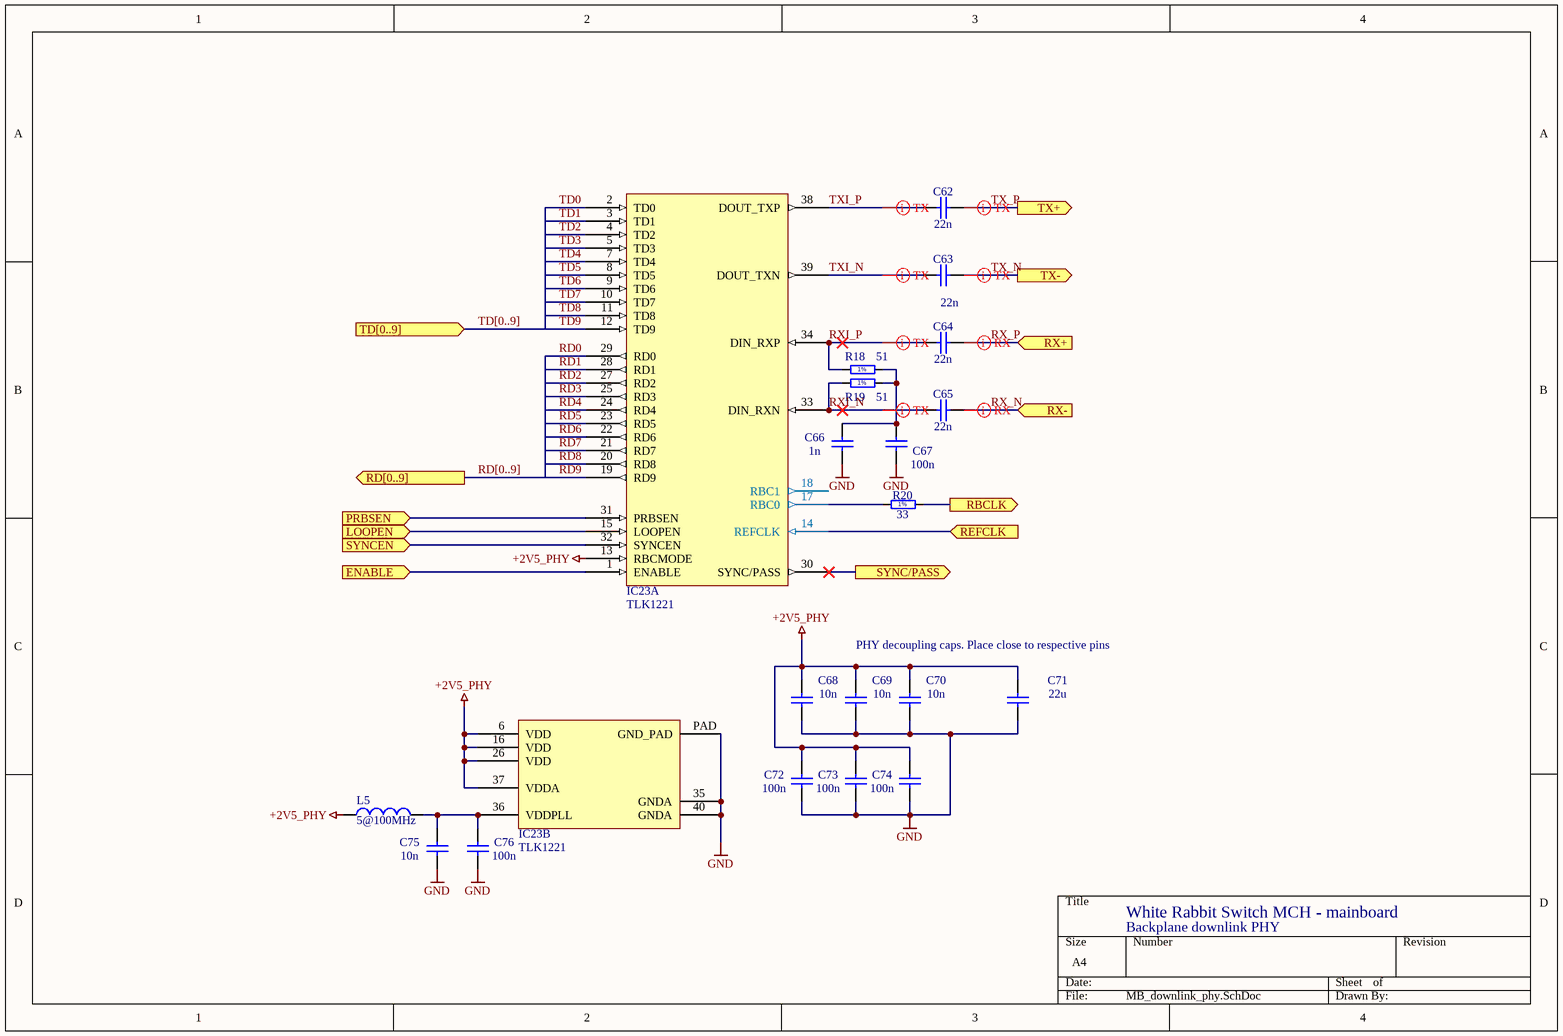
[diagram p18: MB_downlink_phy.SchDoc]

### Parts
C62  22n  [CAPC1005X55N]
C63  22n  [CAPC1005X55N]
C64  22n  [CAPC1005X55N]
C65  22n  [CAPC1005X55N]
C66  1n  [CAPC1005X55N]
C67  100n  [CAPC1005X55N]
C68  10n  [CAPC1005X55N]
C69  10n  [CAPC1005X55N]
C70  10n  [CAPC1005X55N]
C71  22u  [CAPC2012X135N]
C72  100n  [CAPC1005X55N]
C73  100n  [CAPC1005X55N]
C74  100n  [CAPC1005X55N]
C75  10n  [CAPC1005X55N]
C76  100n  [CAPC1005X55N]
IC23  TLK1221  [QFN40_powerpad]  (parts A,B of 2)
L5  value 5@100MHz  [INDC1608-0603]  (hidden comment: Inductor)
R18  51  [RESC1005X40N]
R19  51  [RESC1005X40N]
R20  33  [RESC1005X40N]

### Ports
ENABLE (in), LOOPEN (in), PRBSEN (in), RBCLK (out), RD[0..9] (out), REFCLK (in), RX+ (in), RX- (in), SYNC/PASS (out), SYNCEN (in), TD[0..9] (in), TX+ (out), TX- (out)

### Nets
+2V5_PHY: C68.2 C69.2 C70.2 C71.2 C72.2 C73.2 C74.2 IC23.6(VDD) IC23.13(RBCMODE) IC23.16(VDD) IC23.26(VDD) IC23.37(VDDA) L5.1
GND: C66.1 C67.1 C68.1 C69.1 C70.1 C71.1 C72.1 C73.1 C74.1 C75.1 C76.1 IC23.35(GNDA) IC23.40(GNDA) IC23.PAD(GND_PAD)
ENABLE: IC23.1(ENABLE) ; port ENABLE
LOOPEN: IC23.15(LOOPEN) ; port LOOPEN
PRBSEN: IC23.31(PRBSEN) ; port PRBSEN
RBCLK: R20.2 ; port RBCLK
RD0: IC23.29(RD0)
RD1: IC23.28(RD1)
RD2: IC23.27(RD2)
RD3: IC23.25(RD3)
RD4: IC23.24(RD4)
RD5: IC23.23(RD5)
RD6: IC23.22(RD6)
RD7: IC23.21(RD7)
RD8: IC23.20(RD8)
RD9: IC23.19(RD9)
REFCLK: IC23.14(REFCLK) ; port REFCLK
RX_N: C65.2 ; port RX-
RX_P: C64.2 ; port RX+
RXI_N: C65.1 IC23.33(DIN_RXN) R19.1
RXI_P: C64.1 IC23.34(DIN_RXP) R18.1
SYNC/PASS: IC23.30(SYNC/PASS) ; port SYNC/PASS
SYNCEN: IC23.32(SYNCEN) ; port SYNCEN
TD0: IC23.2(TD0)
TD1: IC23.3(TD1)
TD2: IC23.4(TD2)
TD3: IC23.5(TD3)
TD4: IC23.7(TD4)
TD5: IC23.8(TD5)
TD6: IC23.9(TD6)
TD7: IC23.10(TD7)
TD8: IC23.11(TD8)
TD9: IC23.12(TD9)
TX_N: C63.2 ; port TX-
TX_P: C62.2 ; port TX+
TXI_N: C63.1 IC23.39(DOUT_TXN)
TXI_P: C62.1 IC23.38(DOUT_TXP)
NetC66_2: C66.2 C67.2 R18.2 R19.2
NetC75_2: C75.2 C76.2 IC23.36(VDDPLL) L5.2
NetIC23_17: IC23.17(RBC0) R20.1

Not connected (* = marked no-connect by the designer): IC23 18(RBC1)

### Channels
DP0: designators end in _DP0; ports ENABLE=DP_ENABLE0 LOOPEN=DP_LOOPEN0 PRBSEN=DP_PRBSEN0 RBCLK=fclkin_2v5_1 REFCLK=REFCLK_DP0 RX+=RX_P RX-=RX_N SYNC/PASS=DP_SYNC_PASS0 SYNCEN=DP_SYNCEN0 TX+=TX_P TX-=TX_N
DP1: designators end in _DP1; ports ENABLE=DP_ENABLE1 LOOPEN=DP_LOOPEN1 PRBSEN=DP_PRBSEN1 RBCLK=fclkin_2v5_2 REFCLK=REFCLK_DP1 RX+=RX_P RX-=RX_N SYNC/PASS=DP_SYNC_PASS1 SYNCEN=DP_SYNCEN1 TX+=TX_P TX-=TX_N
DP2: designators end in _DP2; ports ENABLE=DP_ENABLE2 LOOPEN=DP_LOOPEN2 PRBSEN=DP_PRBSEN2 RBCLK=fclkin_2v5_3 REFCLK=REFCLK_DP2 RX+=RX_P RX-=RX_N SYNC/PASS=DP_SYNC_PASS2 SYNCEN=DP_SYNCEN2 TX+=TX_P TX-=TX_N
DP3: designators end in _DP3; ports ENABLE=DP_ENABLE3 LOOPEN=DP_LOOPEN3 PRBSEN=DP_PRBSEN3 RBCLK=fclkin_2v5_4 REFCLK=REFCLK_DP3 RX+=RX_P RX-=RX_N SYNC/PASS=DP_SYNC_PASS3 SYNCEN=DP_SYNCEN3 TX+=TX_P TX-=TX_N
DP4: designators end in _DP4; ports ENABLE=DP_ENABLE4 LOOPEN=DP_LOOPEN4 PRBSEN=DP_PRBSEN4 RBCLK=fclkin_2v5_8 REFCLK=REFCLK_DP4 RX+=RX_P RX-=RX_N SYNC/PASS=DP_SYNC_PASS4 SYNCEN=DP_SYNCEN4 TX+=TX_P TX-=TX_N
DP5: designators end in _DP5; ports ENABLE=DP_ENABLE5 LOOPEN=DP_LOOPEN5 PRBSEN=DP_PRBSEN5 RBCLK=fclkin_2v5_5 REFCLK=REFCLK_DP5 RX+=RX_P RX-=RX_N SYNC/PASS=DP_SYNC_PASS5 SYNCEN=DP_SYNCEN5 TX+=TX_P TX-=TX_N
DP6: designators end in _DP6; ports ENABLE=DP_ENABLE6 LOOPEN=DP_LOOPEN6 PRBSEN=DP_PRBSEN6 RBCLK=fclkin_2v5_7 REFCLK=REFCLK_DP6 RX+=RX_P RX-=RX_N SYNC/PASS=DP_SYNC_PASS6 SYNCEN=DP_SYNCEN6 TX+=TX_P TX-=TX_N
DP7: designators end in _DP7; ports ENABLE=DP_ENABLE7 LOOPEN=DP_LOOPEN7 PRBSEN=DP_PRBSEN7 RBCLK=fclkin_2v5_6 REFCLK=REFCLK_DP7 RX+=RX_P RX-=RX_N SYNC/PASS=DP_SYNC_PASS7 SYNCEN=DP_SYNCEN7 TX+=TX_P TX-=TX_N

### Buses and harness runs
bus RD[0..9] = port RD[0..9]
bus TD[0..9] = port TD[0..9]

### Layout directives
differential pair: RX_N, RX_P, RXI_N_DP0, RXI_P_DP0, TX_N, TX_P, TXI_N_DP0, TXI_P_DP0

### Notes on the sheet
- PHY decoupling caps. Place close to respective pins
- White Rabbit Switch MCH - mainboard
- Backplane downlink PHY
- (in symbol R0402_33R_1%_0.0625W_100PPM) 1%
- (in symbol R0402_51R_1%_0.0625W_100PPM) 1%

### Library data of the parts
C62-C65 = CC0402_22NF_16V_10%_X7R: Non-polarised capacitor; Part Description: SMD Multilayer Chip Ceramic Capacitor; Manufacturer: GENERIC; Manufacturer1 Part Number: 223878715641; Manufacturer1 Datasheet: \\cern.ch\dfs\Applications\Altium\Datasheets\CC0402_X7R_PHYCOMP.pdf; Value: 22nF; Voltage: 16V; TC: X7R; Tolerance: ±10%; Table: Capacitors SMD; Part Number: CC0402_22NF_16V_10%_X7R; Component Kind: Standard; Component Type: Standard; Designator: Capacitor - non polarized; Library Reference: Capacitor - non polarized; Pin Count: 2; Status: Not Recommended; Manufacturer Part Number: CC0402_22NF_16V_10%_X7R; Case: 0402; Mounted: Yes; Socket: No; SMD: Yes; Manufacturer1 Example: PHYCOMP; Manufacturer1 ComponentHeight: 0.55mm; HelpURL: \\cern.ch\dfs\Applications\Altium\Datasheets\CC0402_X7R_PHYCOMP.pdf; Author: CERN DEM JLC; CreateDate: 12/3/2007; LatestRevisionDate: 12/3/2007
C66 = CC0402_1.0NF_50V_10%_X7R: as C2 on sheet MB_clocking; Part Number: CC0402_1.0NF_50V_10%_X7R; Component Kind: Standard; Component Type: Standard; Designator: Capacitor - non polarized; Library Reference: Capacitor - non polarized; Pin Count: 2; Status: Not Recommended; Manufacturer Part Number: CC0402_1.0NF_50V_10%_X7R; Case: 0402; Mounted: Yes; Socket: No; SMD: Yes; Manufacturer1 Example: PHYCOMP; Manufacturer1 ComponentHeight: 0.55mm; HelpURL: \\cern.ch\dfs\Applications\Altium\Datasheets\CC0402_X7R_PHYCOMP.pdf; Author: CERN DEM JLC; CreateDate: 12/3/2007; LatestRevisionDate: 12/3/2007
C67 C72-C74 C76 = CC0402_100NF_16V_10%_X7R: as C1 on sheet MB_clocking; Part Number: CC0402_100NF_16V_10%_X7R; Component Kind: Standard; Component Type: Standard; Designator: Capacitor - non polarized; Library Reference: Capacitor - non polarized; Pin Count: 2; Status: Not Recommended; Manufacturer Part Number: CC0402_100NF_16V_10%_X7R; Case: 0402; Mounted: Yes; Socket: No; SMD: Yes; Manufacturer1 Example: PHYCOMP; Manufacturer1 ComponentHeight: 0.55mm; HelpURL: \\cern.ch\dfs\Applications\Altium\Datasheets\CC0402_X7R_PHYCOMP.pdf; Author: CERN DEM JLC; CreateDate: 12/3/2007; LatestRevisionDate: 12/3/2007
C68-C70 C75 = CC0402_10NF_16V_10%_X7R: as C257 on sheet MB_watchdog_mcu; Part Number: CC0402_10NF_16V_10%_X7R; Component Kind: Standard; Component Type: Standard; Designator: Capacitor - non polarized; Library Reference: Capacitor - non polarized; Pin Count: 2; Status: Not Recommended; Manufacturer Part Number: CC0402_10NF_16V_10%_X7R; Case: 0402; Mounted: Yes; Socket: No; SMD: Yes; Manufacturer1 Example: PHYCOMP; Manufacturer1 ComponentHeight: 0.55mm; HelpURL: \\cern.ch\dfs\Applications\Altium\Datasheets\CC0402_X7R_PHYCOMP.pdf; Author: CERN DEM JLC; CreateDate: 12/3/2007; LatestRevisionDate: 12/3/2007
C71 = CC0805_22uF_6.3V_20%_X5R: as C243 on sheet MB_clocking; Part Number: CC0805_22uF_6.3V_20%_X5R; Component Kind: Standard; Component Type: Standard; Designator: Capacitor - non polarized; Library Reference: Capacitor - non polarized; Pin Count: 2; Status: Preferred; Manufacturer Part Number: CC0805_22uF_6.3V_20%_X5R; Case: 0805; Mounted: Yes; Socket: No; SMD: Yes; Manufacturer1 Example: KEMET; Manufacturer1 ComponentHeight: 1.45mm; HelpURL: \\cern.ch\dfs\Applications\Altium\Datasheets\CC1206_X5R_KEMET.pdf; Author: CERN DEM JLC; CreateDate: 12/3/2007; LatestRevisionDate: 12/3/2007
IC23 = TLK1221: Texas Instruments Gigabit Ethernet PHY with deterministic clocking and LVPECL output interface; RefId: 1576976; Value: TLK1221RHAT; Supplier: Farnell
L5 = Inductor: Ferrite bead; Published: 8-Jun-2000; Revision: July-2002: Re-released for DXP Platform.; Publisher: Altium Limited
R18 R19 = R0402_51R_1%_0.0625W_100PPM: Resistor - 1%; Part Description: General Purpose Thick Film Chip Resistor; Manufacturer: GENERIC; Manufacturer1 Part Number: 232270675109; Manufacturer1 Datasheet: \\cern.ch\dfs\Applications\Altium\Datasheets\R0402_Phycomp_RC0402.pdf; TC: ±100ppm/°C; Table: Resistors SMD; Part Number: R0402_51R_1%_0.0625W_100PPM; Component Kind: Standard; Component Type: Standard; Designator: Resistor - 1%; Library Reference: Resistor - 1%; Pin Count: 2; Value: 51; Status: Not recommended; Power: 0.0625W; Tolerance: ±1%; Manufacturer Part Number: R0402_51R_1%_0.0625W_100PPM; Case: 0402; Mounted: Yes; Socket: No; SMD: Yes; Manufacturer1 Example: PHYCOMP; Manufacturer1 ComponentHeight: 0.4mm; HelpURL: \\cern.ch\dfs\Applications\Altium\Datasheets\R0402_Phycomp_RC0402.pdf; Author: CERN DEM JLC; CreateDate: 12/3/2007; LatestRevisionDate: 3/13/2008
R20 = R0402_33R_1%_0.0625W_100PPM: as R9 on sheet MB_clocking; Part Number: R0402_33R_1%_0.0625W_100PPM; Component Kind: Standard; Component Type: Standard; Designator: Resistor - 1%; Library Reference: Resistor - 1%; Pin Count: 2; Value: 33; Status: Not recommended; Power: 0.0625W; Tolerance: ±1%; Manufacturer Part Number: R0402_33R_1%_0.0625W_100PPM; Case: 0402; Mounted: Yes; Socket: No; SMD: Yes; Manufacturer1 Example: PHYCOMP; Manufacturer1 ComponentHeight: 0.4mm; HelpURL: \\cern.ch\dfs\Applications\Altium\Datasheets\R0402_Phycomp_RC0402.pdf; Author: CERN DEM JLC; CreateDate: 12/3/2007; LatestRevisionDate: 3/13/2008

## Sheet MB_sensors.SchDoc
size A
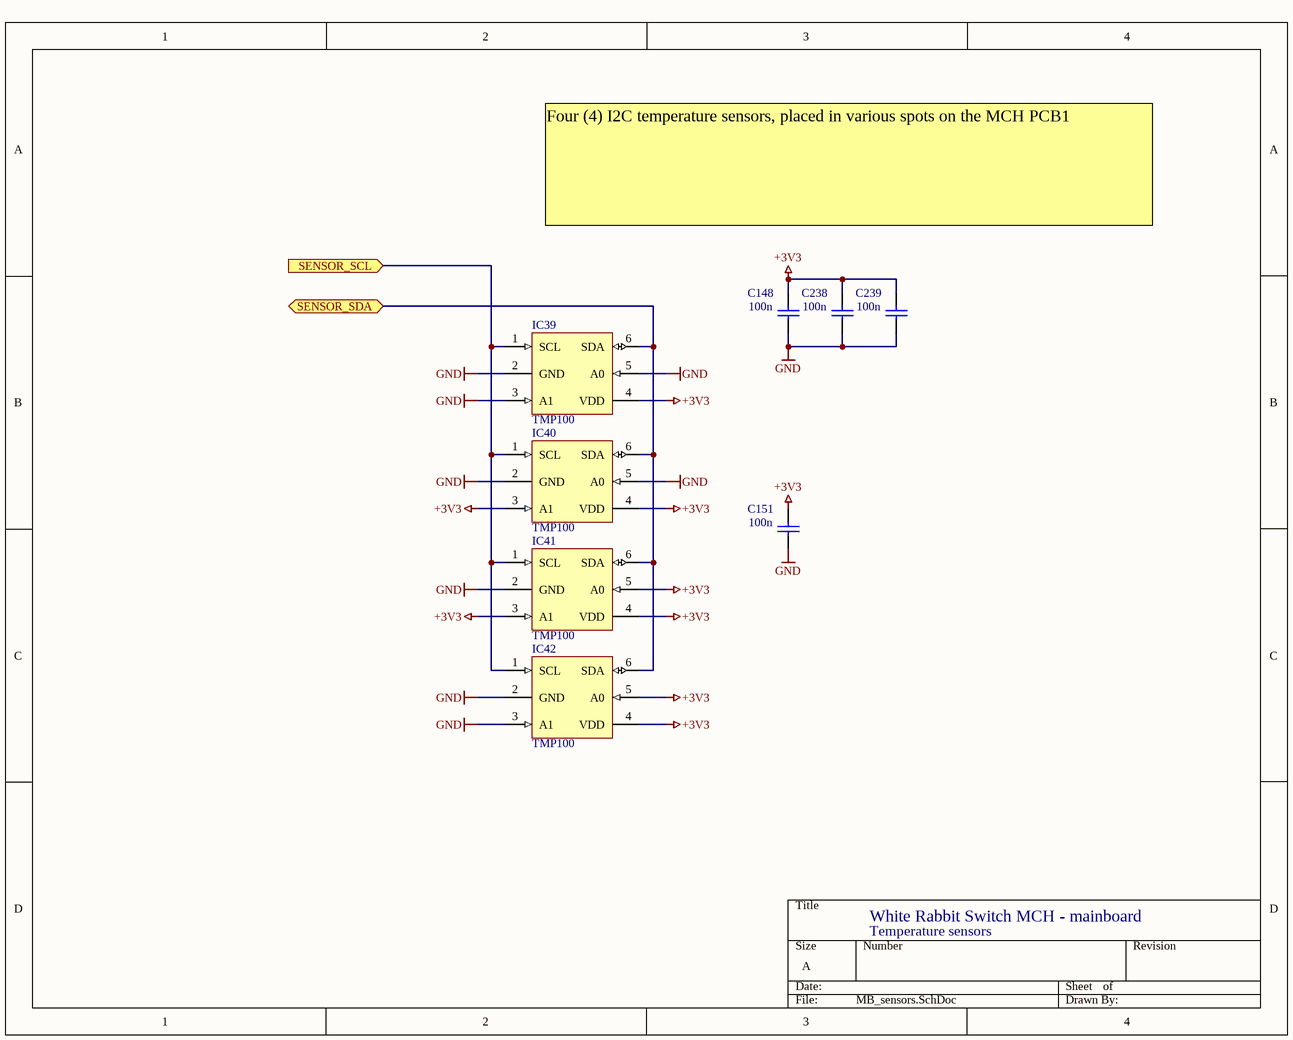
[diagram p19: MB_sensors.SchDoc]

### Parts
C148  100n  [CAPC1005X55N]
C151  100n  [CAPC1005X55N]
C238  100n  [CAPC1005X55N]
C239  100n  [CAPC1005X55N]
IC39  TMP100  [SOT23A-6L]
IC40  TMP100  [SOT23A-6L]
IC41  TMP100  [SOT23A-6L]
IC42  TMP100  [SOT23A-6L]

### Ports
SENSOR_SCL (in), SENSOR_SDA (bidir)

### Nets
+3V3: C148.2 C151.2 C238.2 C239.2 IC39.4(VDD) IC40.3(A1) IC40.4(VDD) IC41.3(A1) IC41.4(VDD) IC41.5(A0) IC42.4(VDD) IC42.5(A0)
GND: C148.1 C151.1 C238.1 C239.1 IC39.2(GND) IC39.3(A1) IC39.5(A0) IC40.2(GND) IC40.5(A0) IC41.2(GND) IC42.2(GND) IC42.3(A1)
MCU_IO1: IC39.1(SCL) IC40.1(SCL) IC41.1(SCL) IC42.1(SCL) ; port SENSOR_SCL
MCU_IO2: IC39.6(SDA) IC40.6(SDA) IC41.6(SDA) IC42.6(SDA) ; port SENSOR_SDA

### Notes on the sheet
- !
- Four (4) I2C temperature sensors, placed in various spots on the MCH PCB1
- White Rabbit Switch MCH - mainboard
- Temperature sensors

### Library data of the parts
C148 C151 C238 C239 = CC0402_100NF_16V_10%_X7R: as C1 on sheet MB_clocking; Part Number: CC0402_100NF_16V_10%_X7R; Component Kind: Standard; Component Type: Standard; Designator: Capacitor - non polarized; Library Reference: Capacitor - non polarized; Pin Count: 2; Status: Not Recommended; Manufacturer Part Number: CC0402_100NF_16V_10%_X7R; Case: 0402; Mounted: Yes; Socket: No; SMD: Yes; Manufacturer1 Example: PHYCOMP; Manufacturer1 ComponentHeight: 0.55mm; HelpURL: \\cern.ch\dfs\Applications\Altium\Datasheets\CC0402_X7R_PHYCOMP.pdf; Author: CERN DEM JLC; CreateDate: 12/3/2007; LatestRevisionDate: 12/3/2007
IC39-IC42 = TMP100: I2C temp. sensor; RefId: 296-12750-1-ND; Value: TMP101NA/250; Supplier: Digikey